# EAGLE design ACS72x-Breakout_v11 (EAGLE 7.7.0)
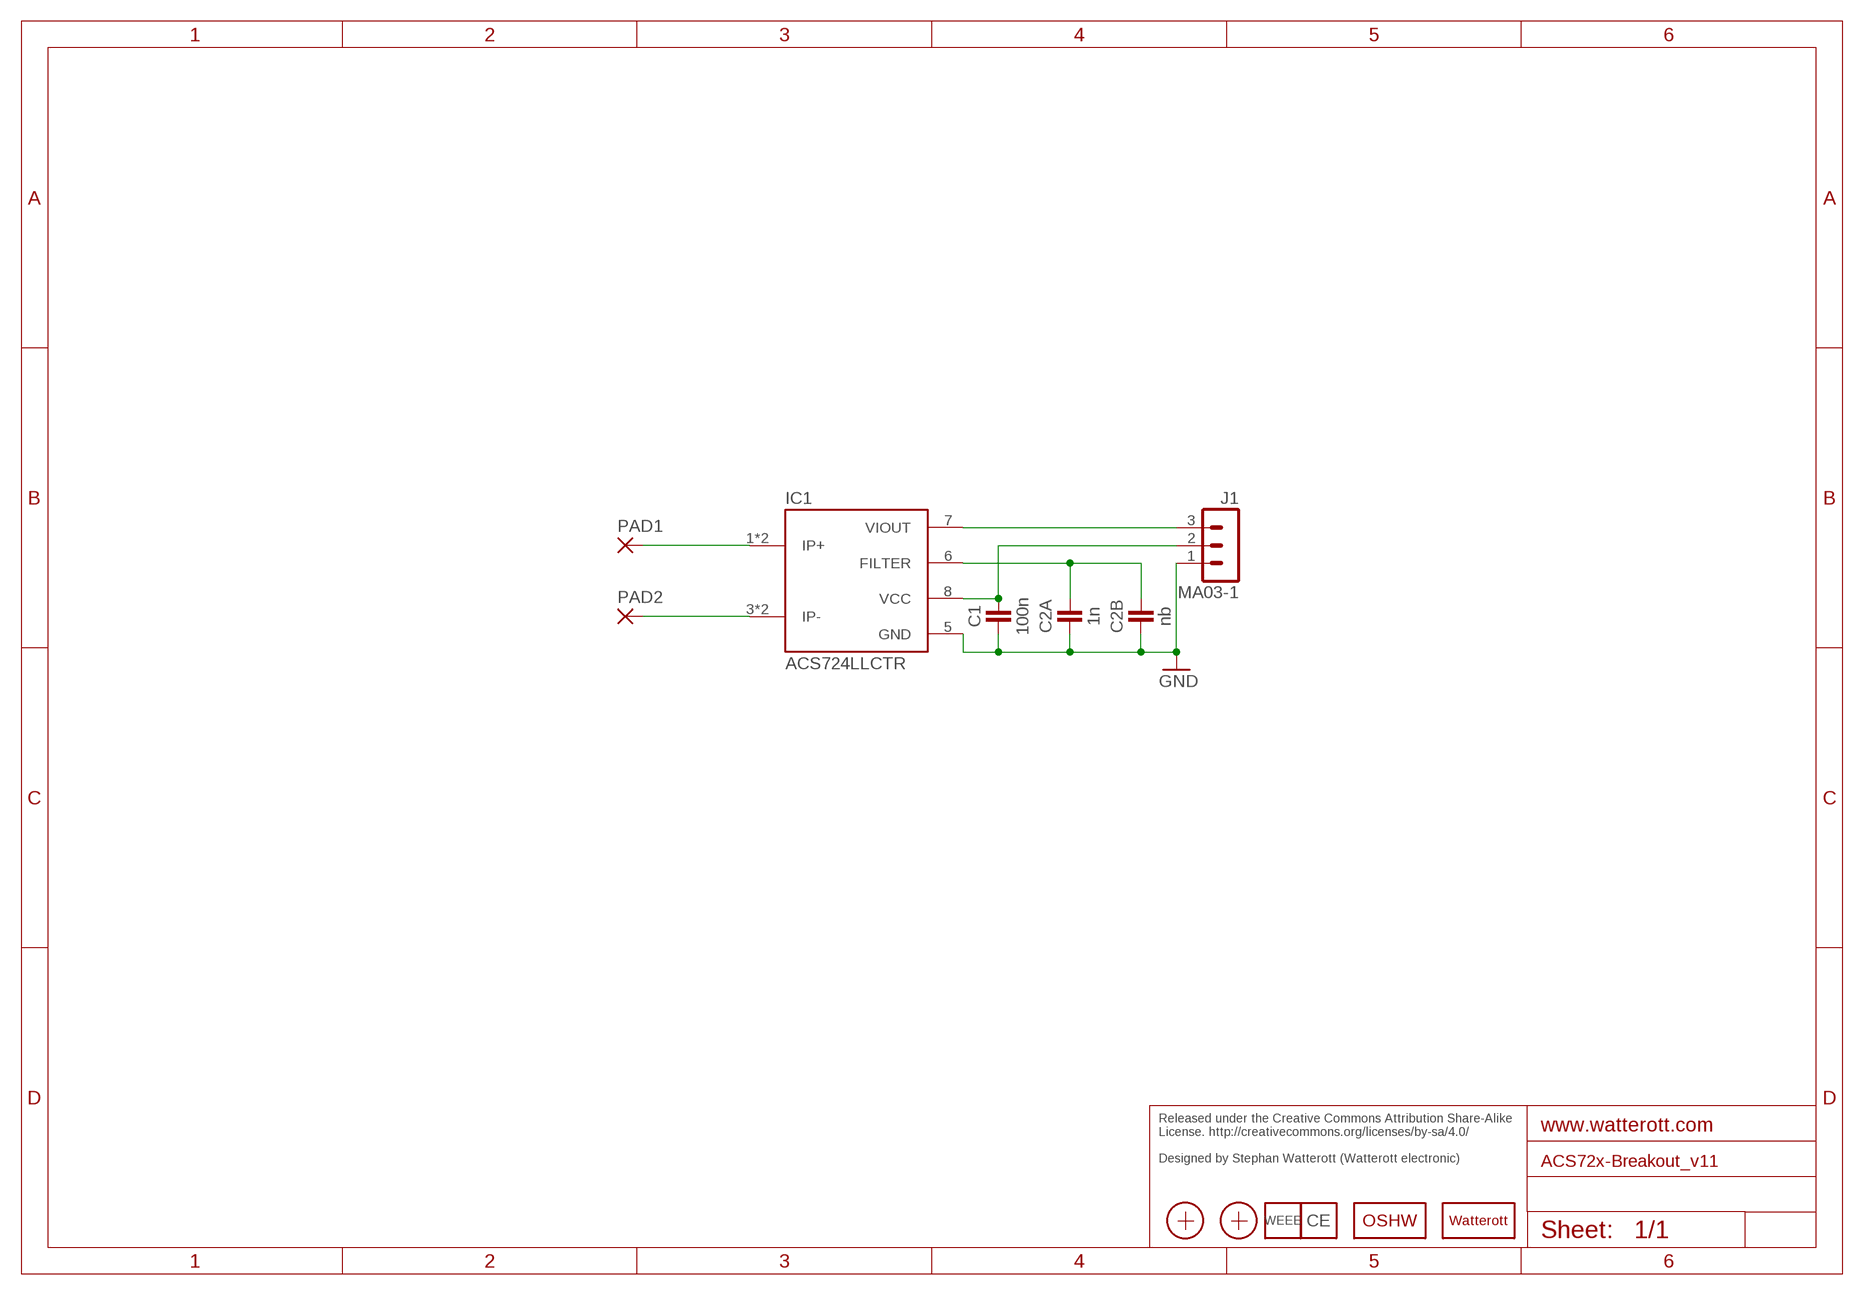
[diagram p0: schematic, sheet 1]

## Parts
C1  100n  CAPACITOR-0402  [C0402]
C2A  1n  CAPACITOR-0402  [C0402]
C2B  nb  CAPACITOR-0603  [C0603]
IC1  ACS724LLCTR  [SO8]
J1  MA03-1  [MA03-1]
LOGO1  LOGO_CE-2  [CE_2MM]
LOGO2  OSHW_LOGOX0070  [OSHW_6X70]
LOGO3  LOGO-S_PLACE_S  [SPARK_TPLACE_S]
LOGO4  LOGO_WEEE-4  [WEEE_4MM]
PAD1  WIREPADSMD5-2,5  [5-2,5]
PAD2  WIREPADSMD5-2,5  [5-2,5]
X1  PASSER-07  [PASSER_07MM]
X2  PASSER-07  [PASSER_07MM]

## Nets
FLT: C2A.2 C2B.2 IC1.6(FILTER)
GND: C1.1 C2A.1 C2B.1 IC1.5(GND) J1.1
IP+: IC1.1(IP+) IC1.2(IP+) PAD1.1(P)
IP-: IC1.3(IP-) IC1.4(IP-) PAD2.1(P)
VCC: C1.2 IC1.8(VCC) J1.2
VIOUT: IC1.7(VIOUT) J1.3

## Notes on the sheet
- Released under the Creative Commons Attribution Share-Alike 
  License. http://creativecommons.org/licenses/by-sa/4.0/
  
  Designed by Stephan Watterott (Watterott electronic)

## Library data of the parts
C1 C2A C2B = we-rcl:CAPACITOR: Capacitors ...2.2uF @ 6.3V -> 0402 ...4.7uF @ 6.3V -> 0603 ...10uF @ 16V -> 0805 ...22uF @ 25V -> 1206
IC1 = we-sensor:ACS724: Allegro ACS724 Hall Effect Current Sensor ACS724 VCC=5V, ACS725 VCC=3.3V -05AB-T +/-5A -10AU-T 10A -10AB-T +/-10A -20AU-T 20A -20AB-T +/-20A -30AU-T 30A -30AB-T +/-30A -50AB-T +/-50A
J1 = we-con:MA03-1: Pin Header
LOGO1 = we-symbol:LOGO_CE: CE Logo
LOGO2 = we-symbol:OSHW_LOGO: Open-Source-Hardware Logo
LOGO3 = we-symbol:LOGO: Watterott electronic Logo
LOGO4 = we-symbol:LOGO_WEEE: WEEE Logo
PAD1 PAD2 = wirepad:WIREPAD: Wire PAD connect wire on PCB
X1 X2 = we-symbol:PASSER: Fiducial Markers

## Board
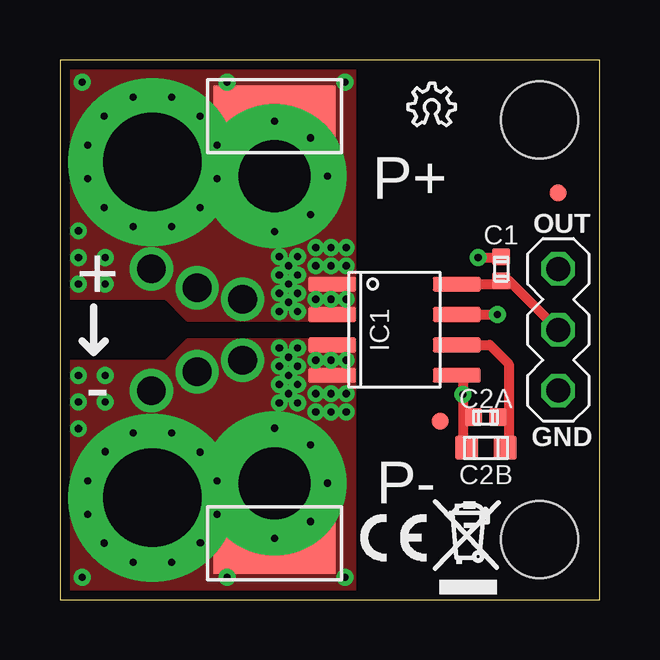
[diagram p1: board, top side]
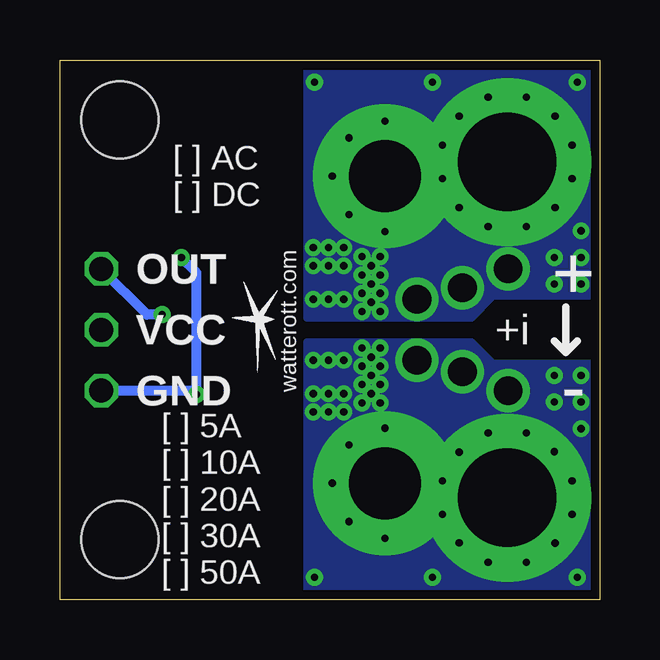
[diagram p2: board, bottom side, seen from below]

Size 22.5 x 22.5 mm. Coordinates in mm from the lower left corner, seen from the top.
Outline: 0,0 22.5,0 22.5,22.5 0,22.5 0,0
Copper layers (1*16): Top 0.035mm / dielectric 1.5mm / Bottom 0.035mm
Design rules "we-dru-2-layer": minimum track width 0.15mm, minimum drill 0.3mm, track to track 0.15mm, track to pad 0.15mm, pad to pad 0.15mm, via to via 0.15mm, smd to smd 0.1mm, copper to edge 0.4mm, drill to drill 0.2mm, minimum pad ring 0.18mm, minimum via ring 0.2mm, stop-mask expansion 0.1mm, vias tented up to drill 0.5mm, thermal gap 0.25mm
Holes 3.2 mm at 20,2.5 20,20

### Footprints (pad centres in the part's own frame; a part is rotated, then mirrored left to right if it is on the bottom)
C0402 = smd 0.75 x 0.7: 1 0,0.5; 2 0,-0.5
C0603 = smd 1 x 0.95: 1 0,0.8; 2 0,-0.8
SO8 = smd 2 x 0.6: 1 -2.6,1.905; 2 -2.6,0.635; 3 -2.6,-0.635; 4 -2.6,-1.905; 5 2.6,-1.905; 6 2.6,-0.635; 7 2.6,0.635; 8 2.6,1.905
MA03-1 = drill 1 octagon: 1 0,2.54; 2 0,0; 3 0,-2.54
5-2,5 = smd 2.54 x 5.08: 1 0,0
PASSER_07MM = smd 0.7 x 0.7: X 0,0

### Placement (x,y rotation side)
C1  18.39,13.79 0 top
C2A  17.76,7.6 90 top
C2B  17.76,6.33 90 top
IC1  13.95,11.25 0 top
J1  20.77,11.25 180 top
LOGO1  13.9,2.58 0 top
LOGO2  14.51,19.76 0 top
LOGO3  14.22,11.66 270 bottom
LOGO4  16.96,2.21 0 top
PAD1  8.95,20.15 90 top
PAD2  8.95,2.35 90 top
X1  20.77,16.96 0 top
X2  15.85,7.44 0 top

### Tracks (layer width: path | path; a pad name or v marks a point on that pad's centre or on a via)
FLT
  Top 0.406: IC1.6 17.92,10.62 18.71,9.82 18.71,7.6 | 18.71,7.6 18.71,6.48 C2B.2 | C2A.2 18.71,7.6
GND  (via drill 0.3)
  Top 0.406: IC1.5 16.81,9.35 v16.81,8.55 16.81,7.6 | 16.81,7.6 16.81,6.48 C2B.1 | C2A.1 16.81,7.6 | v17.44,14.27 18.37,14.27 C1.1
  Bottom 0.406: J1.1 16.96,8.71 v16.81,8.55 16.81,13.63 v17.44,14.27
IP+  (via drill 0.3, 1.2 pad 1.78, 3 pad 6, 4.1 pad 7)
  other vias: 3.85,18.25 8.95,17.65 3.81,13.79 5.71,13 7.62,12.52 9.14,12.77 9.91,12.01 9.14,13.54 9.91,12.77 9.91,13.54 10.67,13.92 11.3,13.92 11.94,13.92 0.77,13.15 1.88,13.15 1.88,14.27 0.77,14.27 0.93,21.57 11.88,21.57 10.67,12.52 11.3,12.52 11.94,12.52 9.53,13.15 9.14,12.01 9.53,12.39 9.91,14.3 9.14,14.3 10.67,14.68 11.3,14.68 11.94,14.68 9.53,13.92 0.77,15.38 6.96,21.57 6.55,17.55 5.85,16.35 4.65,15.55 3.05,15.55 1.85,16.35 1.15,17.55 1.15,18.95 1.85,20.15 3.05,20.95 4.65,20.95 5.85,20.15 6.55,18.95 11.15,17.65 8.95,19.95 10.45,19.25 10.45,16.05 8.95,15.35
  pour Top (no thermals): 0,22.5 12.2,22.5 12.2,11.75 5.35,11.75 4.45,12.65 0,12.65
  pour Bottom (no thermals): 0,22.5 12.2,22.5 12.2,11.75 5.35,11.75 4.45,12.65 0,12.65
IP-  (via drill 0.3, 1.2 pad 1.78, 3 pad 6, 4.1 pad 7)
  other vias: 3.85,4.25 8.95,4.85 3.81,8.71 5.71,9.5 7.62,9.98 9.14,10.49 9.91,10.49 9.14,9.73 9.91,9.73 9.91,8.96 10.67,8.58 11.3,8.58 11.94,8.58 6.55,3.55 5.85,2.36 4.65,1.55 3.05,1.55 1.85,2.35 1.15,3.55 1.15,4.95 1.88,6.17 3.05,6.95 4.65,6.95 5.85,6.15 6.55,4.95 0.77,9.35 0.77,8.23 1.88,9.35 1.88,8.23 0.93,0.93 11.88,0.93 10.67,9.98 11.94,9.98 11.3,9.98 9.14,8.96 9.53,9.35 9.53,10.11 10.67,7.82 11.3,7.82 11.94,7.82 9.91,8.2 9.14,8.2 9.53,8.58 0.77,7.12 6.96,0.93 8.95,7.15 10.45,6.45 11.15,4.85 10.45,3.25 8.95,2.55
  pour Top (no thermals): 0,0 12.2,0 12.2,10.75 5.35,10.75 4.45,9.85 0,9.85
  pour Bottom (no thermals): 0,0 12.2,0 12.2,10.75 5.35,10.75 4.45,9.85 0,9.85
VCC
  Top 0.406: IC1.8 18.87,13.15 | 18.87,13.15 J1.2 | C1.2 18.73,13.29 18.87,13.15
VIOUT  (via drill 0.3)
  Top 0.406: IC1.7 v18.23,11.88
  Bottom 0.406: v18.23,11.88 18.87,11.88 J1.3

### Text on the board
tPlace: P+ | OUT | + | - | GND | P-
bPlace: [ ] AC / [ ] DC | OUT | + | +i | watterott.com | VCC | - | GND | [ ] 5A / [ ] 10A / [ ] 20A / [ ] 30A / [ ] 50A
Measures: Pitch: 2.54mm / Pitch: 3.50mm / Pitch: 5.08mm
Reference: Silkscreen: 21 tPlace + 22 bPlace